# Altium schematic sheet Interface.SchDoc
size B
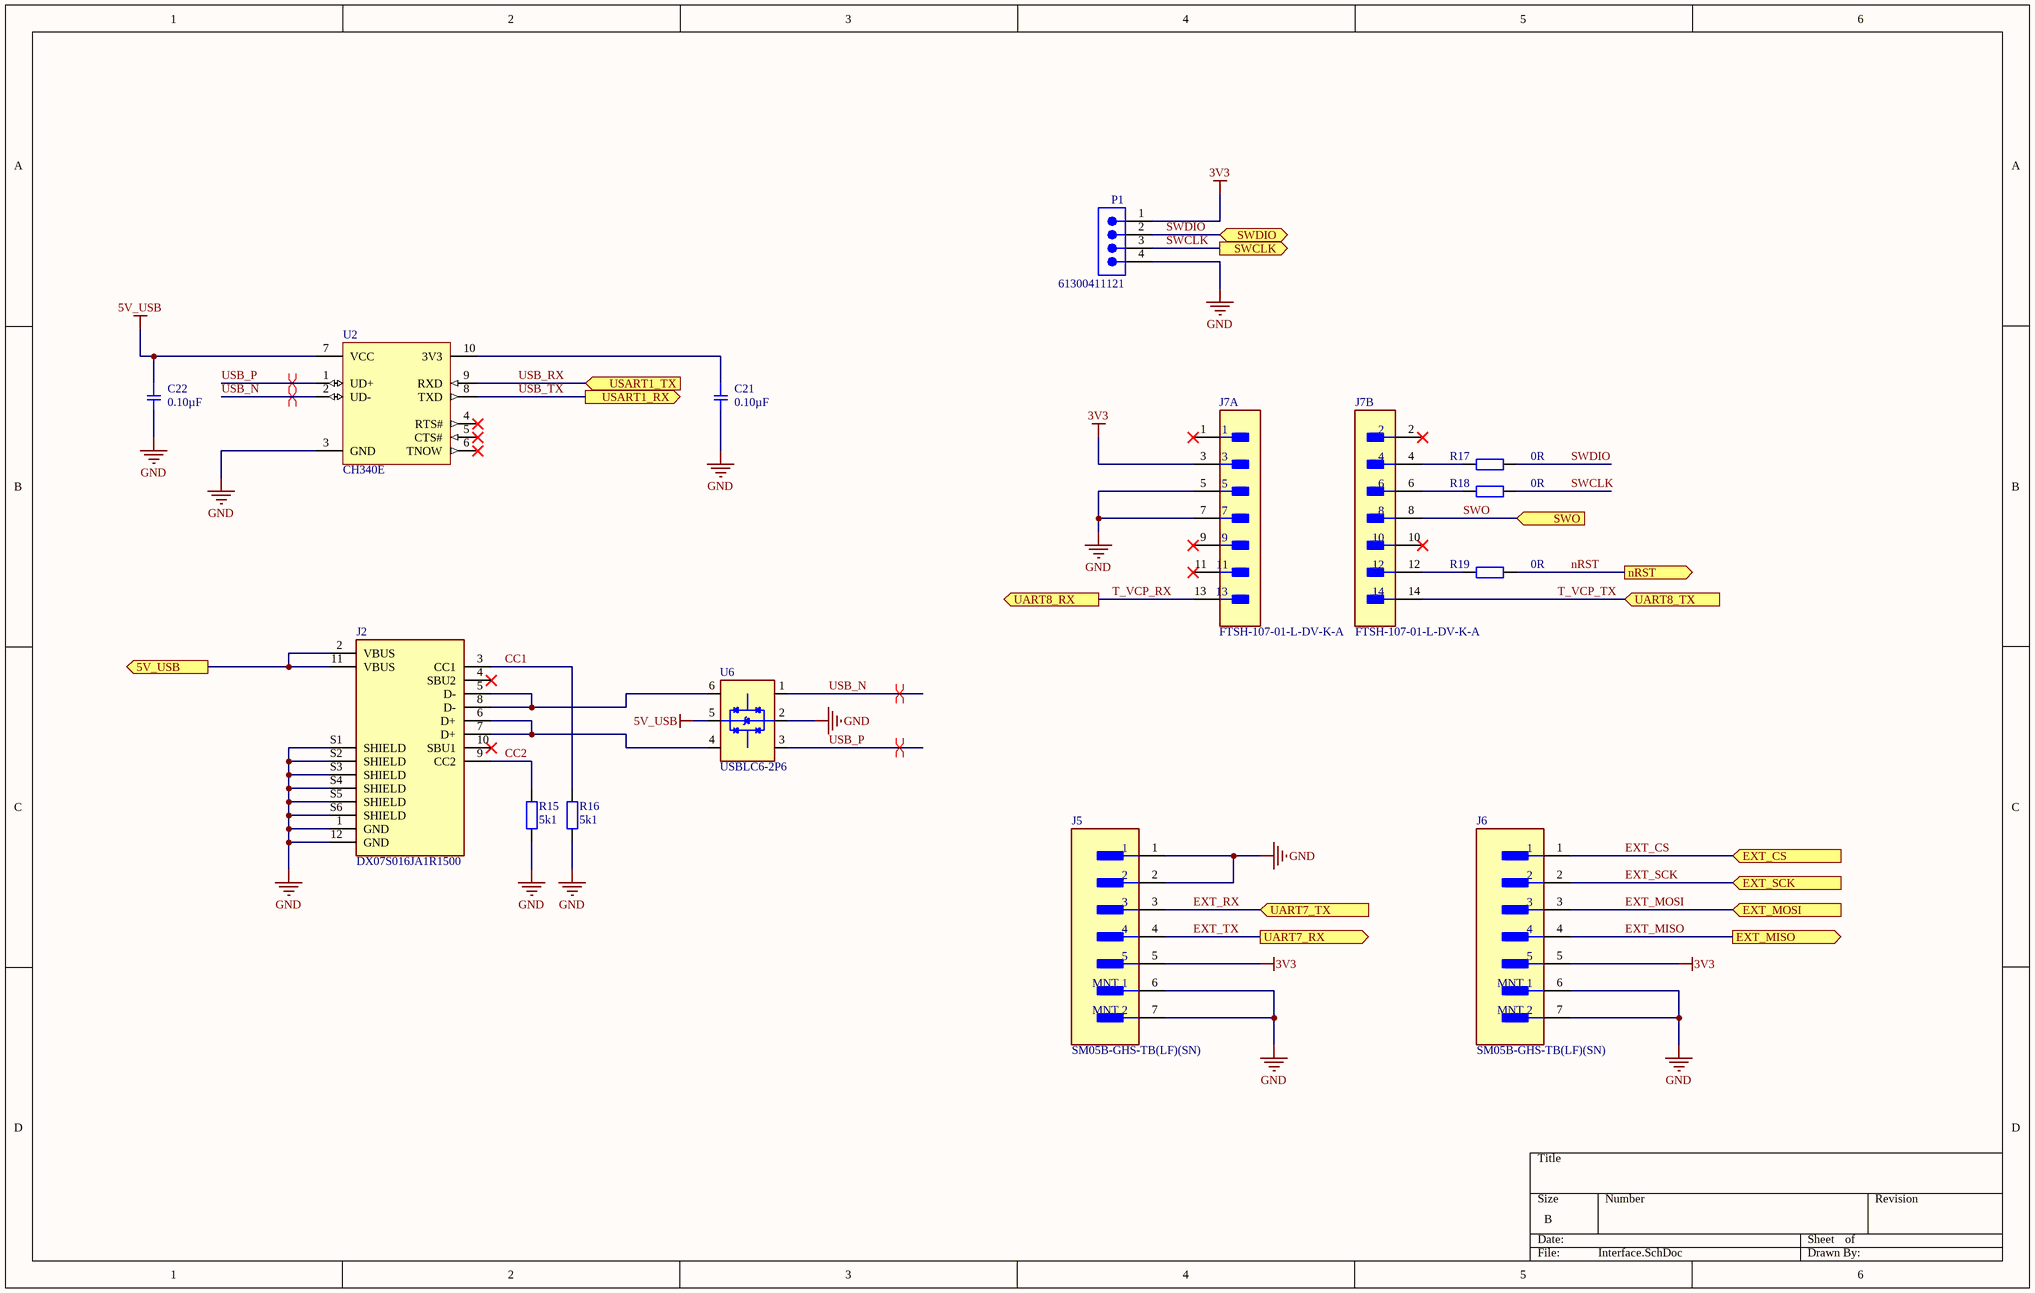
[diagram p0: Interface.SchDoc]

## Parts
C21  value 0.10µF  [SMD-0402C]  (hidden comment: GRM155R61A104KA01J)
C22  value 0.10µF  [SMD-0402C]  (hidden comment: GRM155R61A104KA01J)
J2  DX07S016JA1R1500  [JAE_DX07S016JA1R1500]
J5  SM05B-GHS-TB(LF)(SN)  [FP-SM05B-GHS-TB_LF_SN-MFG]
J6  SM05B-GHS-TB(LF)(SN)  [FP-SM05B-GHS-TB_LF_SN-MFG]
J7  FTSH-107-01-L-DV-K-A  [FP-FTSH-107-01-L-DV-K-A-MFG]  (parts A,B of 2)
P1  61300411121  [61300411121]
R15  value 5k1  [IPC C R0402 NO SILK]  (hidden comment: 5.1k)
R16  value 5k1  [IPC C R0402 NO SILK]  (hidden comment: 5.1k)
R17  0R  [IPC C R0402 NO SILK]
R18  0R  [IPC C R0402 NO SILK]
R19  0R  [IPC C R0402 NO SILK]
U2  CH340E  [MSOP-UN10_L]
U6  USBLC6-2P6  [SOT50P160X60-6N]

## Ports
5V_USB (out), EXT_CS (in), EXT_MISO (out), EXT_MOSI (in), EXT_SCK (in), nRST (out), SWCLK (out), SWDIO (bidir), SWO (in), UART7_RX (out), UART7_TX (in), UART8_RX (out), UART8_TX (in), USART1_RX (out), USART1_TX (in)

## Nets
3V3: J5.5 J6.5 J7.3 P1.1
5V_USB: C22.1 U2.7(VCC) U6.5(VBUS)
GND: C21.2 C22.2 J2.1(GND) J2.12(GND) J2.S1(SHIELD) J2.S2(SHIELD) J2.S3(SHIELD) J2.S4(SHIELD) J2.S5(SHIELD) J2.S6(SHIELD) J5.1 J5.2 J5.6(MNT_1) J5.7(MNT_2) J6.6(MNT_1) J6.7(MNT_2) J7.5 J7.7 P1.4 R15.2 R16.2 U2.3(GND) U6.2(GND)
5V_USB: J2.2(VBUS) J2.11(VBUS) ; port 5V_USB  [a separate net that carries the same name]
CC1: J2.3(CC1) R16.1
CC2: J2.9(CC2) R15.1
EXT_CS: J6.1 ; port EXT_CS
EXT_MISO: J6.4 ; port EXT_MISO
EXT_MOSI: J6.3 ; port EXT_MOSI
EXT_RX: J5.3 ; port UART7_TX
EXT_SCK: J6.2 ; port EXT_SCK
EXT_TX: J5.4 ; port UART7_RX
nRST: R19.2 ; port nRST
SWCLK: P1.3 R18.2 ; port SWCLK
SWDIO: P1.2 R17.2 ; port SWDIO
SWO: J7.8 ; port SWO
T_VCP_RX: J7.13 ; port UART8_RX
T_VCP_TX: J7.14 ; port UART8_TX
USB_N: U2.2(UD-) U6.1(I/O1_1)
USB_P: U2.1(UD+) U6.3(I/O2_1)
USB_RX: U2.9(RXD) ; port USART1_TX
USB_TX: U2.8(TXD) ; port USART1_RX
NetC21_1: C21.1 U2.10(3V3)
NetJ2_5: J2.5(D-) J2.8(D-) U6.6(I/O1_2)
NetJ2_6: J2.6(D+) J2.7(D+) U6.4(I/O2_2)
NetJ7_4: J7.4 R17.1
NetJ7_6: J7.6 R18.1
NetJ7_12: J7.12 R19.1

Not connected (* = marked no-connect by the designer): J2 4(SBU2)* 10(SBU1)*; J7 1* 2* 9* 10* 11*; U2 4(RTS#)* 5(CTS#)* 6(TNOW)*

## Layout directives
differential pair: USB_N, USB_P

## Library data of the parts
C21 C22 = CMP-140-000687-1: CAP CER 0.1UF 10V X5R 0402; Manufacturer: Murata Electronics North America; Factory Stock: 0; Unit Price (USD): 0.1; Minimum Quantity: 1; Tolerance: ±10%; Ratings: -; Lead Spacing: -; Source: capacitor_murata_0402$.SchLib; Part Status: Active; Pin Count: 2; Digi-Key Part Number: 490-6297-1-ND; Operating Temperature: -55°C ~ 85°C; Height - Seated (Max): -; Voltage: 10V; @ qty: 0; Temperature Coefficient: X5R; Package / Case: 0402 (1005 Metric); Size / Dimension: 0.039" L x 0.020" W (1.00mm x 0.50mm); Quantity Available: 24406; Datasheets: http://www.murata.com/~/media/webrenewal/support/library/catalog/products/capacitor/mlcc/c02e.pdf; Series: GRM; Applications: General Purpose; Thickness (Max): 0.022" (0.55mm); Image: //media.digikey.com/Renders/Murata%20Renders/ZRB-SERIES-0402.jpg; Packaging: Cut Tape (CT); Part Number: GRM155R61A104KA01J; Features: -; Component Type: Standard; Mounting Type: Surface Mount, MLCC; Design Item ID: GRM155R61A104KA01J
J2 = CMP-003-000003-4: USB-C (USB TYPE-C) USB 2.0 Receptacle Connector 24 (16+8 Dummy) Position Surface Mount, Right Angle; Through Hole; Pin Count: 18; Component Type: Standard; Availability: Unavailable; Design Item ID: DX07S016JA1R1500; Price: None; Value: *; Source: DX07S016JA1R1500.SchLib; Package: None; MP: DX07S016JA1R1500
J5 J6 = CMP-17439-000048-1: CONN HEADER SMD R/A 5POS 1.25MM; Current Rating: 1A; Pitch: 0.049inch; Connector Type: Outer Shroud Contact; Number of Positions: 5; Voltage Rating (AC): 50V; Wire/Cable Gauge: 26AWG; Series: GH; Mount: Surface Mount; Housing Material: Nylon; Contact Type: Outer Shroud Contact; REACH SVHC: No SVHC; Number of Rows: 1; Lead Free: Lead Free; Color: Natural; Contact Material: Bronze; Contact Plating: Tin; Max Operating Temperature: 85°C; Orientation: Right Angle; Number of Contacts: 5; Voltage Rating: 50V; Housing Color: Natural; Termination: Solder; Min Operating Temperature: -25°C; Fastening Type: Ramp; Packaging: Tape and Reel
J7 = CMP-02766-001414-1: CONN HEADER SMD 14POS 1.27MM; Number of Contacts: 14; Gender: Male; Contact Plating: Gold; Termination: Solder; Lead Free: Lead Free; Contact Material: Bronze; Pitch: 1.27mm; Number of Rows: 2; RoHS Compliant: Yes
P1 = CMP-1502-01064-4: THT Vertical Pin Header WR-PHD, Pitch 2.54 mm, Single Row, 4 pins; Connector Type: Male Pin; Gender: Male; Current Rating: 3A; Number of Positions: 4; Operating Supply Voltage: 250V; Contact Resistance: 20mΩ; Pitch: 2.54mm; Max Operating Temperature: 105°C; Mount: Through Hole; Contact Material: Gold; Contact Plating: Gold; Number of Contacts: 4; Orientation: Vertical; Packaging: Bulk; Contact Mating Length: 5.9944mm; Voltage Rating: 250V; Number of Rows: 1; Height: 8.89mm; Lead Free: Lead Free; Lead Pitch: 2.54mm; Number of Pins: 4; Color: Black; Min Operating Temperature: -40°C; RoHS: Compliant; Termination: Solder
R15-R19 = CMP-009-00183-1: Design Item ID: Generic RES 0402; Source: Schlib1.SchLib
  R17-R19: Value: 0R
U2 = CMP-023-000028-1: Source: Schlib1.SchLib; Design Item ID: CH340E
U6 = CMP-004-00043-1: 17V Clamp 5A (8/20Âµs) Ipp Tvs Diode Surface Mount SOT-666; MF: STMicroelectronics; Component Type: Standard; Check_prices: https://www.snapeda.com/parts/USBLC6-2P6/STMicroelectronics/view-part/?ref=eda; Value: *; Design Item ID: USBLC6-2P6; MP: USBLC6-2P6; Pins: 6; Case/Package: SOT-666 STMicroelectronics; SnapEDA_Link: https://www.snapeda.com/parts/USBLC6-2P6/STMicroelectronics/view-part/?ref=snap; Source: USBLC6-2P6.SchLib